# Altium schematic sheet STM32G030C8.SchDoc
size A4
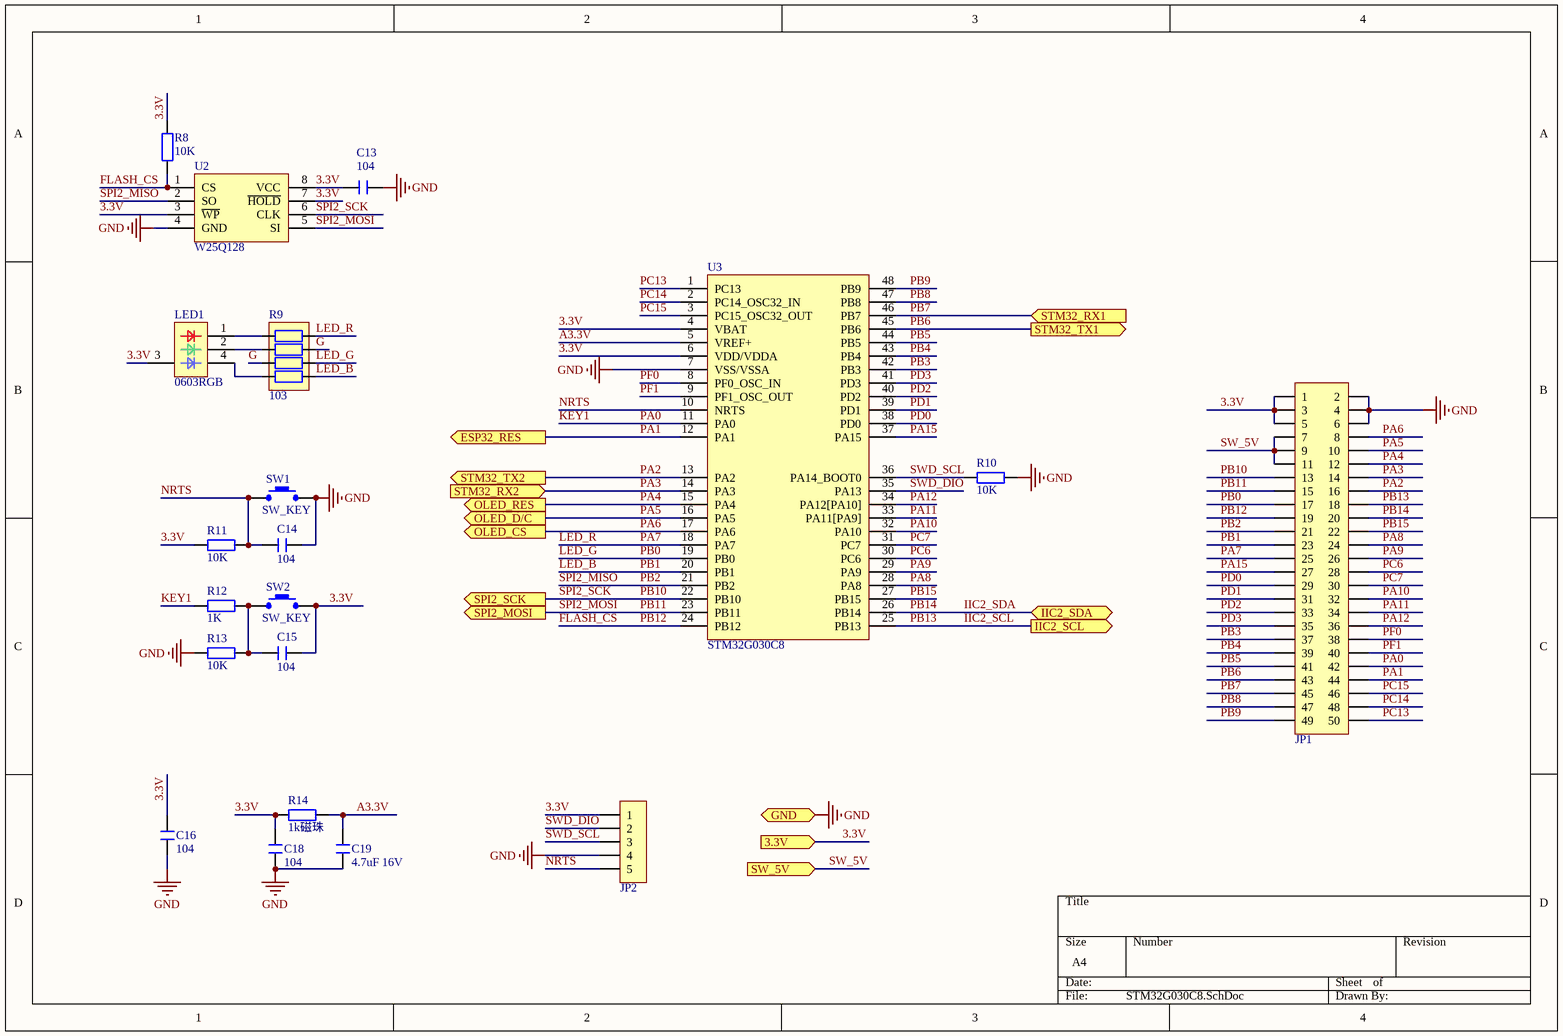
[diagram p0: STM32G030C8.SchDoc]

## Parts
C13  104  [C 0603_L]
C14  104  [C 0603_L]
C15  104  [C 0603_L]
C16  104  [C 0603_L]
C18  104  [C 0603_L]
C19  4.7uF 16V  [C 0603_L]
JP1  Header 2X25  [CHE2*25]  (value not drawn)
JP2  HDR-1X5  [CHE1*5]  (value not drawn)
LED1  0603RGB  [0603RGB]
R8  10K  [R 0603_L]
R9  103  [RCA-8P4R-0402]
R10  10K  [R 0603_L]
R11  10K  [R 0603_L]
R12  1K  [R 0603_L]
R13  10K  [R 0603_L]
R14  1k磁珠  [R 0603_L]
SW1  SW_KEY  [TSW SMD-4*4*1.5]
SW2  SW_KEY  [TSW SMD-4*4*1.5]
U2  W25Q128  [SOP8W_L]
U3  STM32G030C8  [LQFP48_L]

## Ports
3.3V (in), ESP32_RES (out), GND, IIC2_SCL (out), IIC2_SDA, OLED_CS (out), OLED_D/C (out), OLED_RES (out), SPI2_MOSI (out), SPI2_SCK (out), STM32_RX1 (in), STM32_RX2 (in), STM32_TX1 (out), STM32_TX2 (out), SW_5V (in)

## Nets
GND: C13.2 C14.1 C16.1 C18.1 C19.1 JP1.2 JP1.4 JP1.6 JP2.4 R10.1 R13.2 SW1.4(D) U2.4(GND) U3.7(VSS/VSSA) ; port GND
3.3V: C13.1 C15.1 C16.2 C18.2 JP1.1 JP1.3 JP1.5 JP2.1 LED1.3(VCC) R8.2 R11.2 R14.1 SW2.4(D) U2.3(~{WP}) U2.7(~{HOLD}) U2.8(VCC) U3.4(VBAT) U3.6(VDD/VDDA) ; port 3.3V
A3.3V: C19.2 R14.2 U3.5(VREF+)
FLASH_CS: JP1.19 R8.1 U2.1(CS) U3.24(PB12)  [also labelled PB12]
G: R9.3 R9.7
IIC2_SCL: JP1.18 U3.25(PB13) ; port IIC2_SCL  [also labelled PB13]
IIC2_SDA: JP1.20 U3.26(PB14) ; port IIC2_SDA  [also labelled PB14]
KEY1: JP1.42 R12.2 U3.11(PA0)  [also labelled PA0]
LED_B: JP1.23 R9.5 U3.20(PB1)  [also labelled PB1]
LED_G: JP1.17 R9.6 U3.19(PB0)  [also labelled PB0]
LED_R: JP1.25 R9.8 U3.18(PA7)  [also labelled PA7]
NRTS: C14.2 JP2.5 R11.1 SW1.1(A) U3.10(NRTS)
PA1: JP1.44 U3.12(PA1) ; port ESP32_RES
PA2: JP1.16 U3.13(PA2) ; port STM32_TX2
PA3: JP1.14 U3.14(PA3) ; port STM32_RX2
PA4: JP1.12 U3.15(PA4) ; port OLED_RES
PA5: JP1.10 U3.16(PA5) ; port OLED_D/C
PA6: JP1.8 U3.17(PA6) ; port OLED_CS
PA8: JP1.24 U3.28(PA8)
PA9: JP1.26 U3.29(PA9)
PA10: JP1.32 U3.32(PA10)
PA11: JP1.34 U3.33(PA11[PA9])
PA12: JP1.36 U3.34(PA12[PA10])
PA15: JP1.27 U3.37(PA15)
PB2: JP1.21 U2.2(SO) U3.21(PB2)  [also labelled SPI2_MISO]
PB3: JP1.37 U3.42(PB3)
PB4: JP1.39 U3.43(PB4)
PB5: JP1.41 U3.44(PB5)
PB6: JP1.43 U3.45(PB6) ; port STM32_TX1
PB7: JP1.45 U3.46(PB7) ; port STM32_RX1
PB8: JP1.47 U3.47(PB8)
PB9: JP1.49 U3.48(PB9)
PB10: JP1.13 U2.6(CLK) U3.22(PB10) ; port SPI2_SCK  [also labelled SPI2_SCK]
PB11: JP1.15 U2.5(SI) U3.23(PB11) ; port SPI2_MOSI  [also labelled SPI2_MOSI]
PB15: JP1.22 U3.27(PB15)
PC6: JP1.28 U3.30(PC6)
PC7: JP1.30 U3.31(PC7)
PC13: JP1.50 U3.1(PC13)
PC14: JP1.48 U3.2(PC14_OSC32_IN)
PC15: JP1.46 U3.3(PC15_OSC32_OUT)
PD0: JP1.29 U3.38(PD0)
PD1: JP1.31 U3.39(PD1)
PD2: JP1.33 U3.40(PD2)
PD3: JP1.35 U3.41(PD3)
PF0: JP1.38 U3.8(PF0_OSC_IN)
PF1: JP1.40 U3.9(PF1_OSC_OUT)
SW_5V: JP1.7 JP1.9 JP1.11 ; port SW_5V
SWD_DIO: JP2.2 U3.35(PA13)
SWD_SCL: JP2.3 R10.2 U3.36(PA14_BOOT0)
NetC15_2: C15.2 R12.1 R13.1 SW2.1(A)
NetLED1_1: LED1.1(R) R9.1
NetLED1_2: LED1.2(G) R9.2
NetLED1_4: LED1.4(B) R9.4

## Library data of the parts
C13-C16 C18 C19 = C: 贴片电容; BOM名称: 无极性贴片电容; 优秀评价可免费更新: 联系淘宝ID：黄晶宝石，获取更新版封装库; 卖家免费技术支持，联系售后: 唯一出售店铺网址https://shop463601444.taobao.com; 本封装库来自淘宝卖家 ID：黄晶宝石: 其他店铺购入均为盗版，请立即申请退款
JP1 = Header 25X2: 25*2P接插件; BOM名称: 20*2P接插件; 版权归属: 封装库来自淘宝 ID：黄晶宝石; 优秀评价可免费更新: 联系淘宝ID：黄晶宝石，获取更新版封装库; 卖家免费技术支持，联系售后: 唯一出售店铺网址https://shop463601444.taobao.com
JP2 = Header 5: 5P接插件; 版权归属: 封装库来自淘宝 ID：黄晶宝石; 优秀评价可免费更新: 联系淘宝ID：黄晶宝石，获取更新版封装库; 卖家免费技术支持，联系售后: 唯一出售店铺网址https://shop463601444.taobao.com; BOM名称: 5P接插件
R8 R10-R14 = R: 贴片电阻; 优秀评价可免费更新: 联系淘宝ID：黄晶宝石，获取更新版封装库; 卖家免费技术支持，联系售后: 唯一出售店铺网址https://shop463601444.taobao.com; 本封装库来自淘宝卖家 ID：黄晶宝石: 其他店铺购入均为盗版，请立即申请退款; BOM名称: 贴片电阻
R9 = R-8P4R: 贴片排阻; BOM名称: 贴片网络排阻; 优秀评价可免费更新: 联系淘宝ID：黄晶宝石，获取更新版封装库; 卖家免费技术支持，联系售后: 唯一出售店铺网址https://shop463601444.taobao.com; 本封装库来自淘宝卖家 ID：黄晶宝石: 其他店铺购入均为盗版，请立即申请退款
U3 = STM32G030C8: STM32G0系列